# EAGLE schematic Shifter (EAGLE 9.4.2)
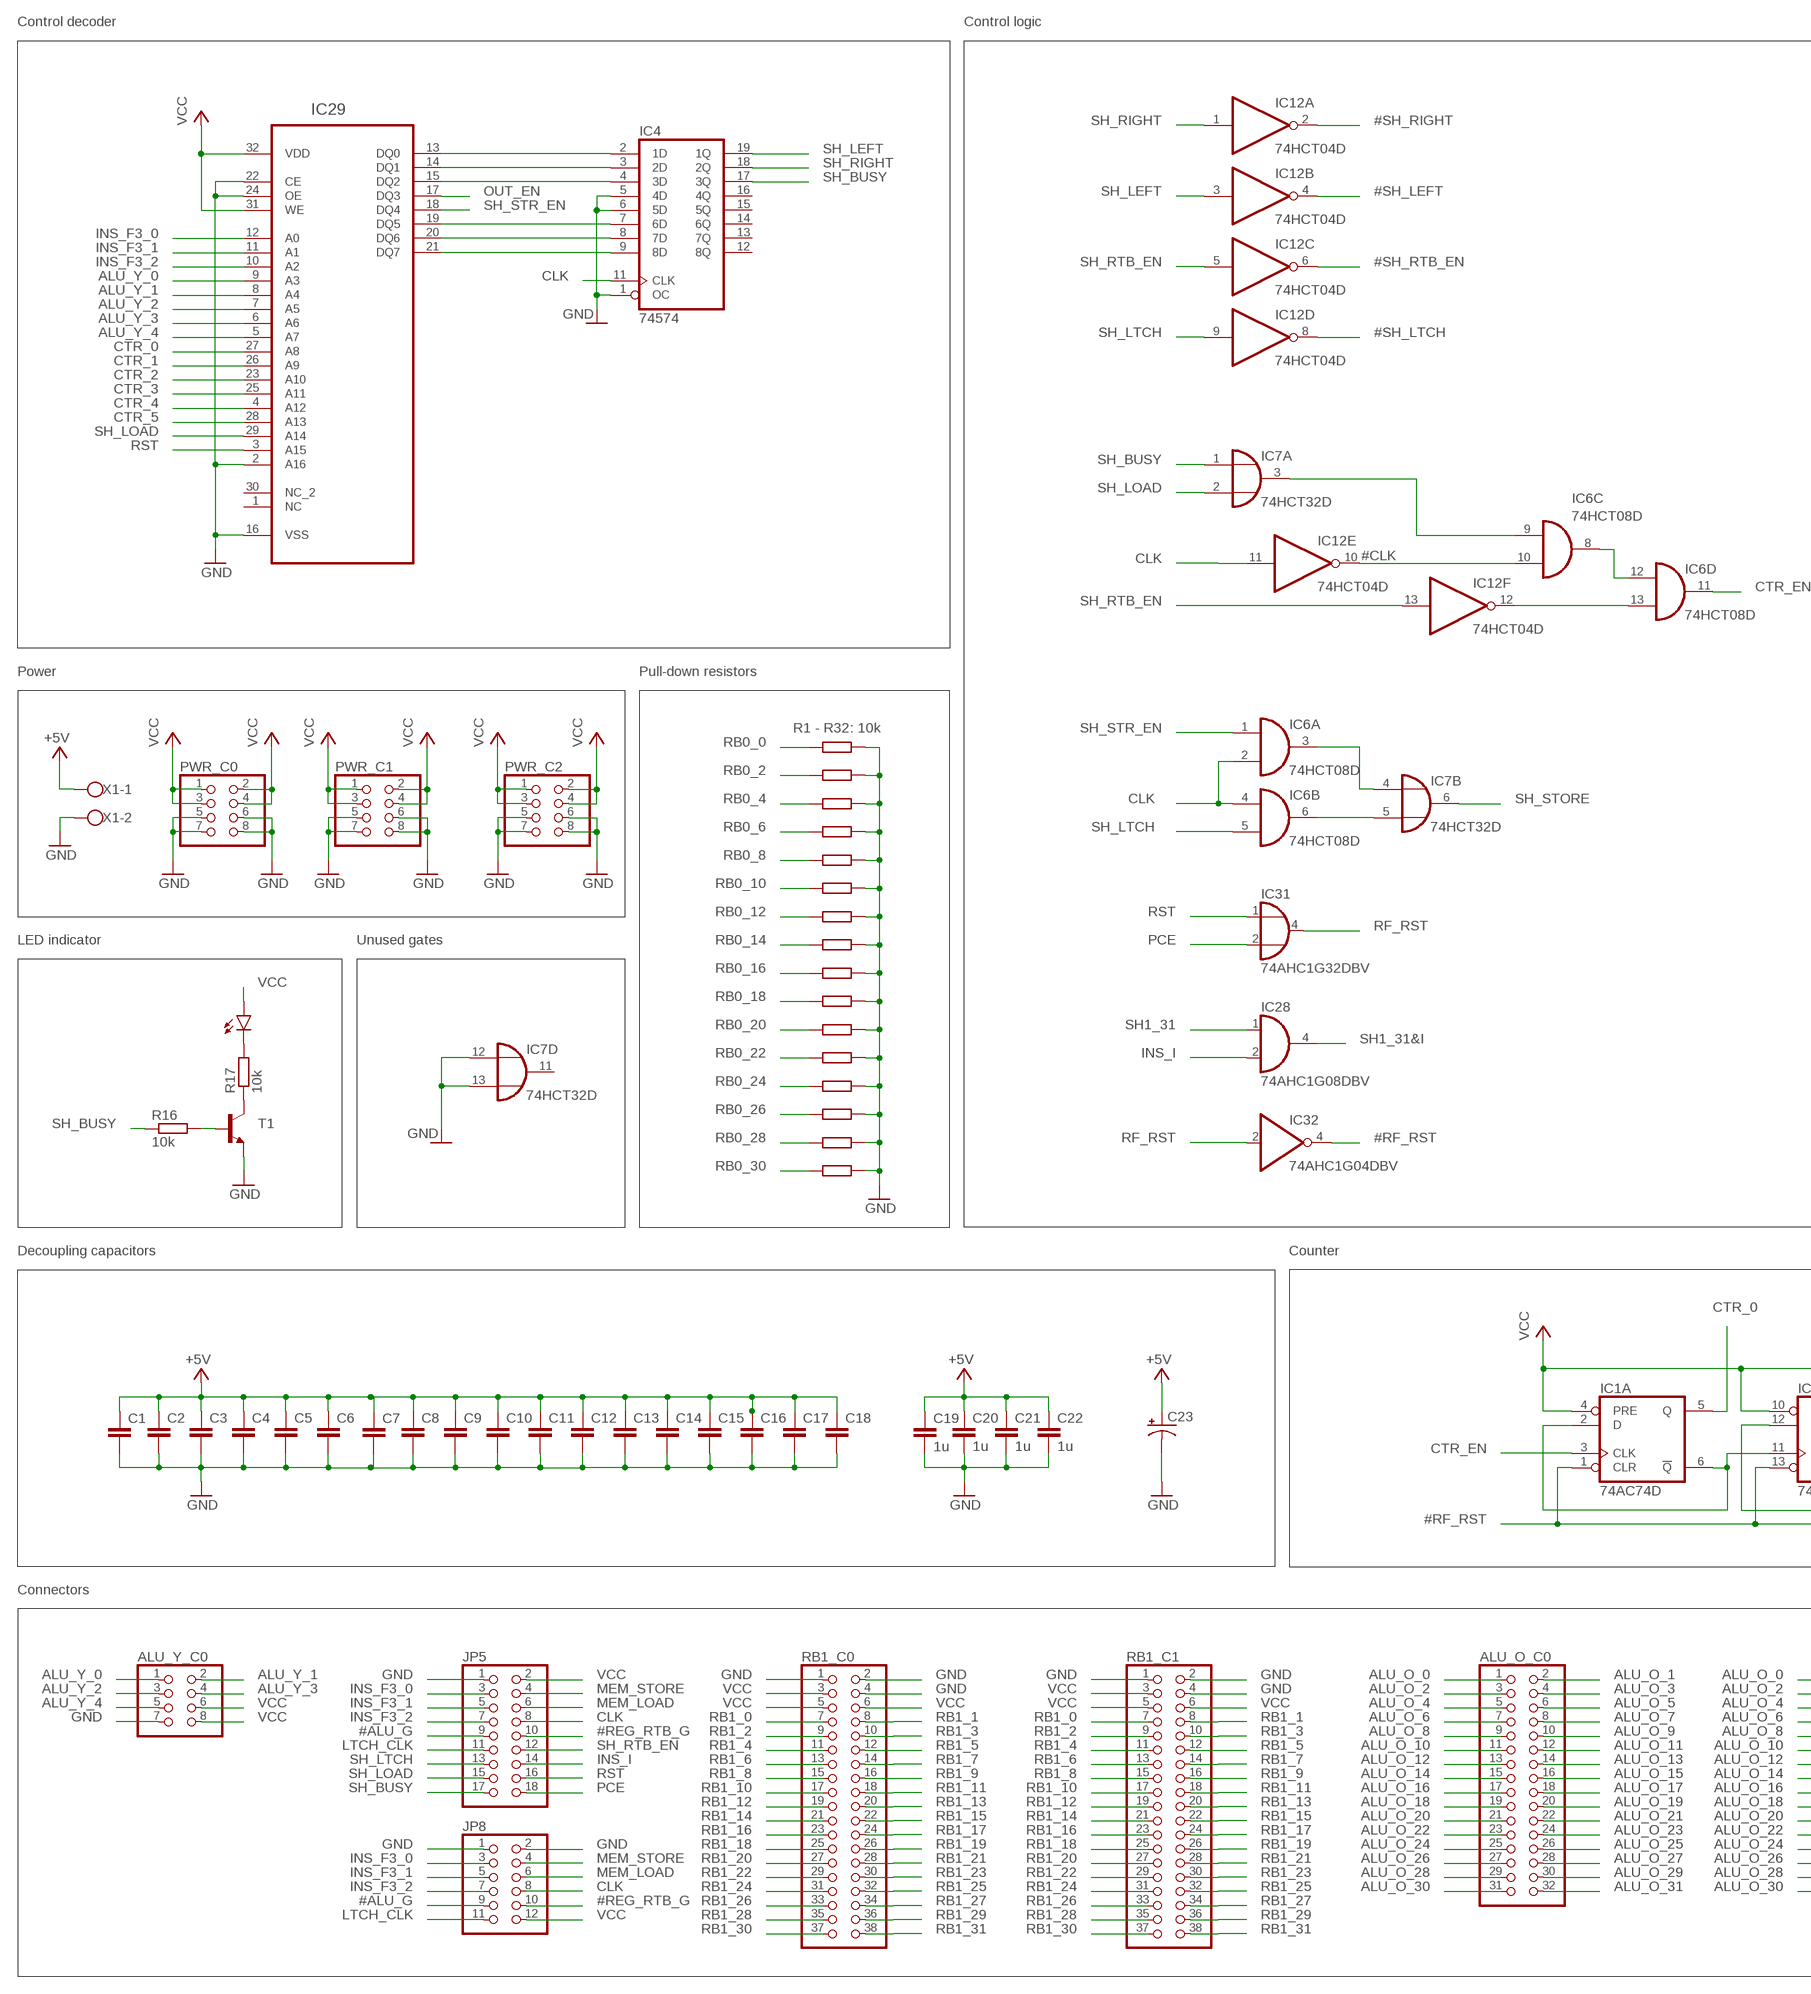
[diagram p0: schematic, sheet 1, part 1 of 2]
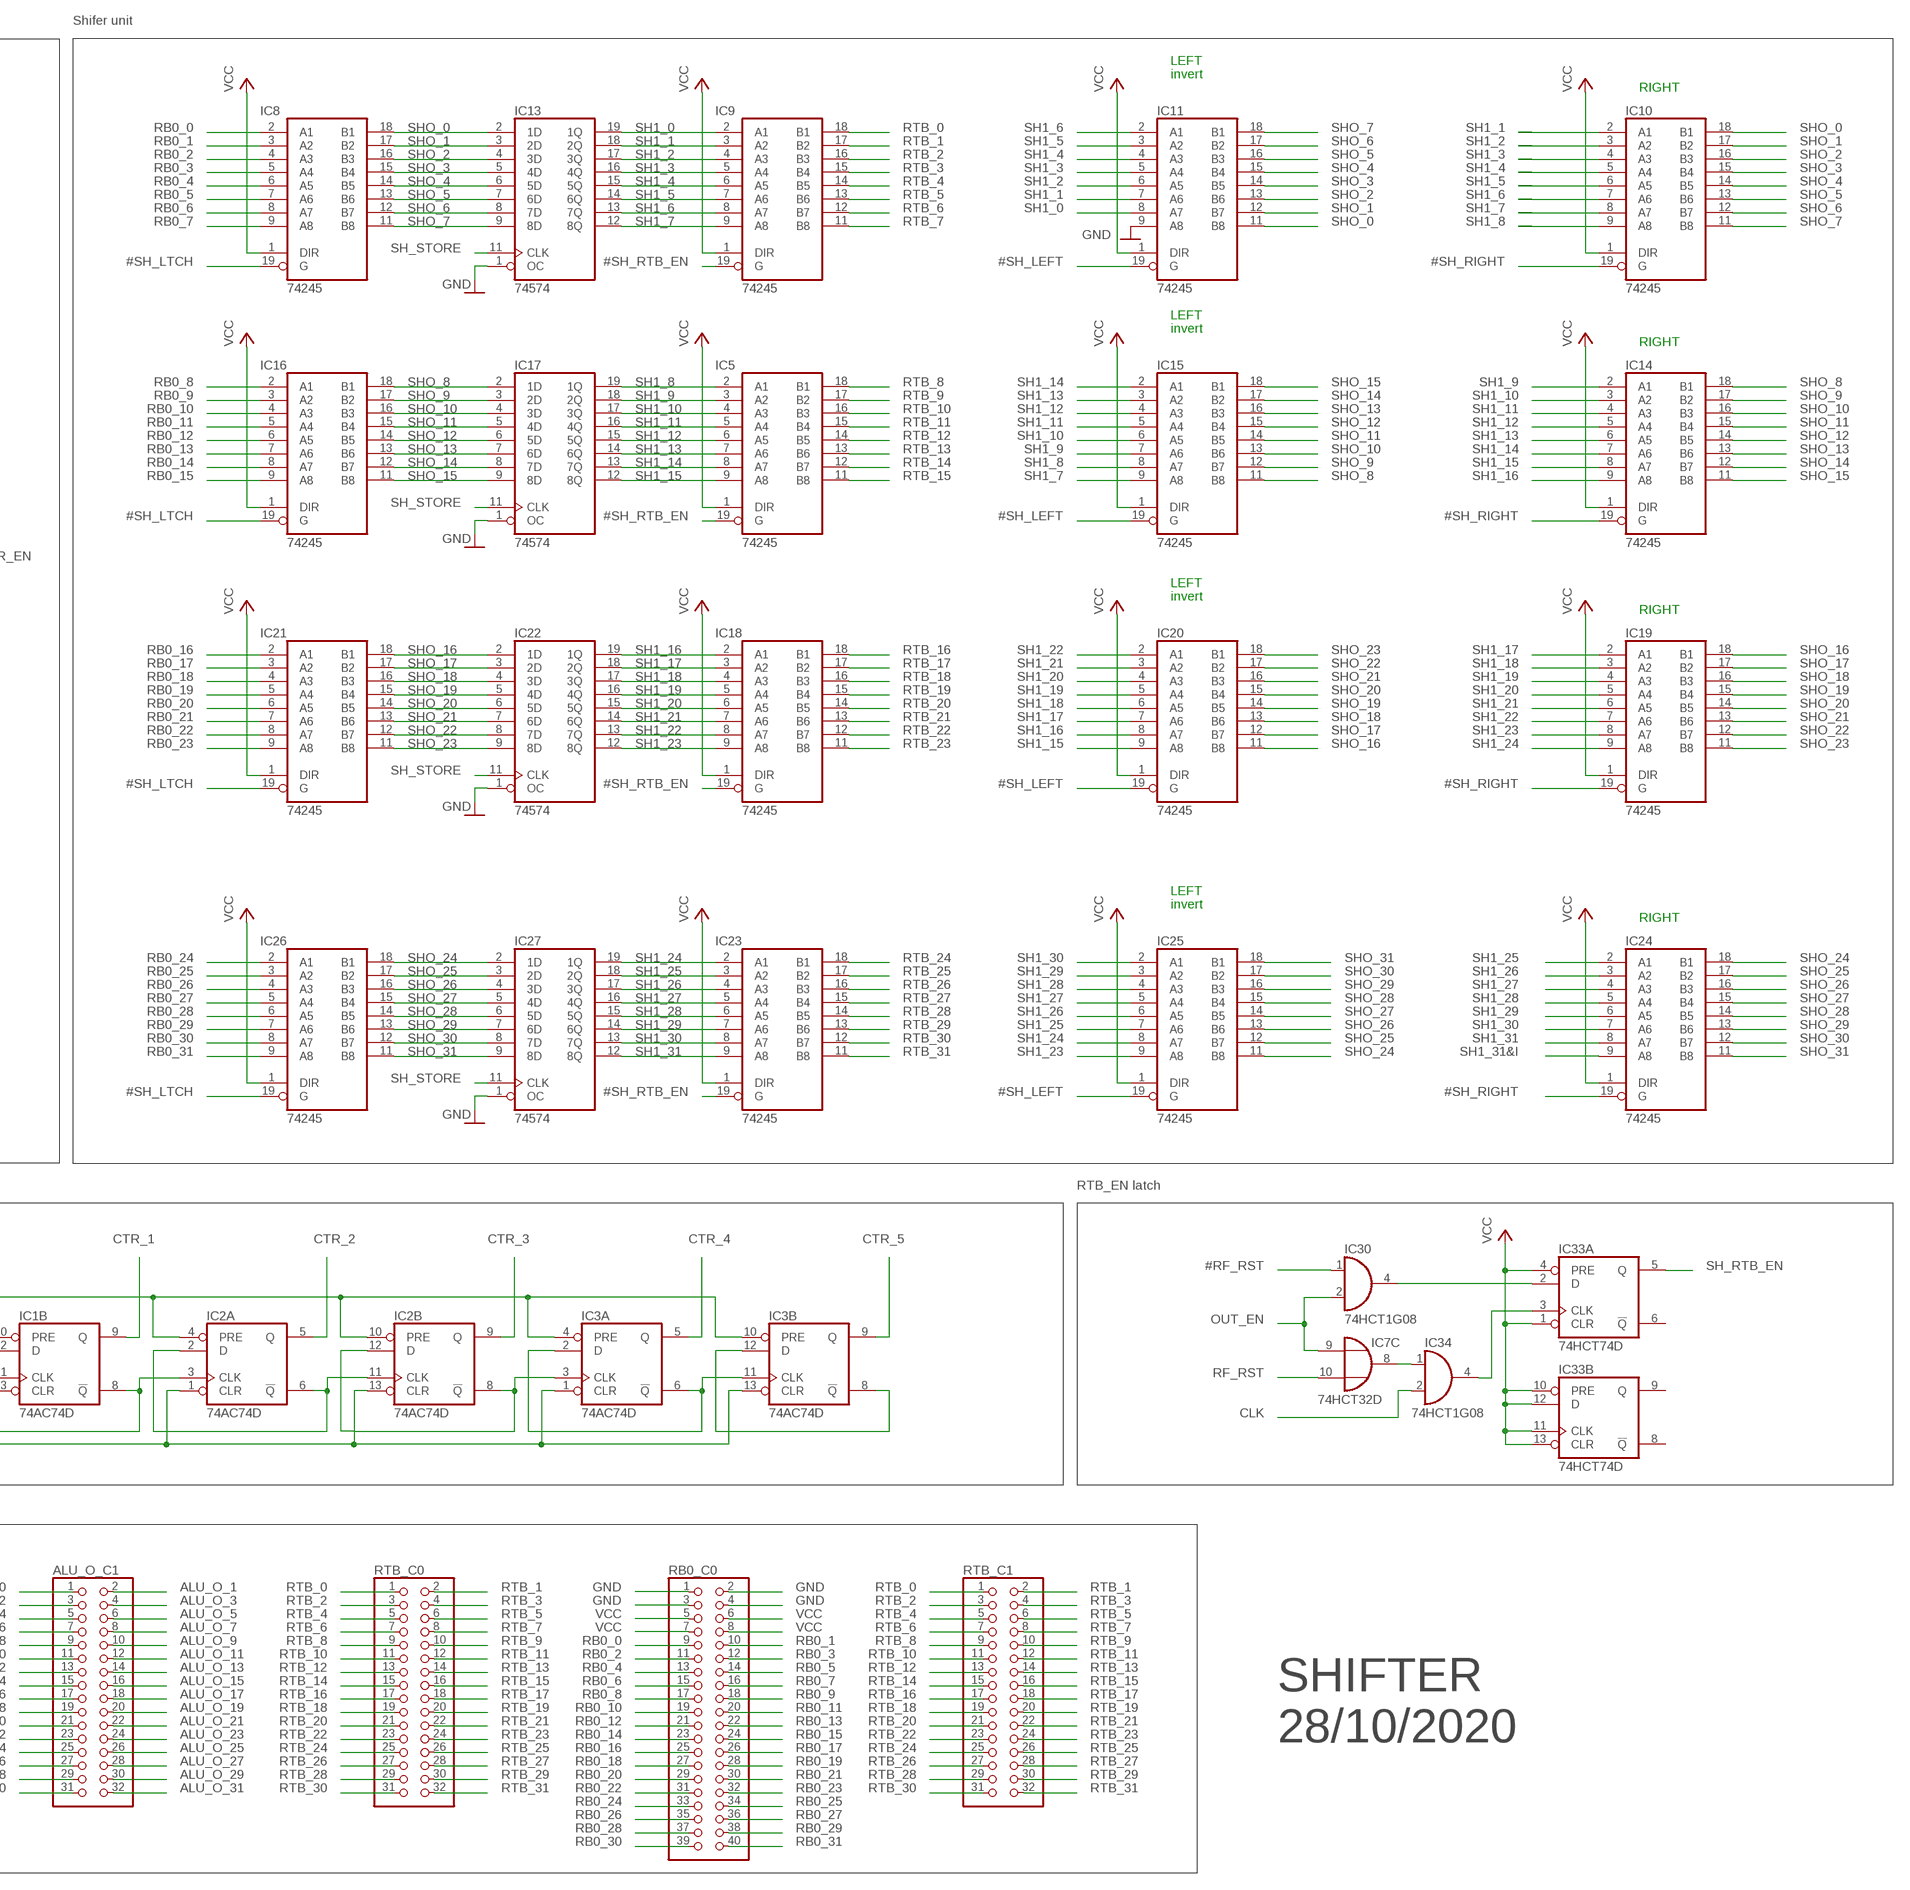
[diagram p1: schematic, sheet 1, part 2 of 2]

## Parts
ALU_O_C0  PINHD-2X16  [2X16]
ALU_O_C1  PINHD-2X16  [2X16]
ALU_Y_C0  PINHD-2X4  [2X04]
C1  C-EUC0805  [C0805]
C2  C-EUC0805  [C0805]
C3  C-EUC0805  [C0805]
C4  C-EUC0805  [C0805]
C5  C-EUC0805  [C0805]
C6  C-EUC0805  [C0805]
C7  C-EUC0805  [C0805]
C8  C-EUC0805  [C0805]
C9  C-EUC0805  [C0805]
C10  C-EUC0805  [C0805]
C11  C-EUC0805  [C0805]
C12  C-EUC0805  [C0805]
C13  C-EUC0805  [C0805]
C14  C-EUC0805  [C0805]
C15  C-EUC0805  [C0805]
C16  C-EUC0805  [C0805]
C17  C-EUC0805  [C0805]
C18  C-EUC0805  [C0805]
C19  1u  C-EUC0805  [C0805]
C20  1u  C-EUC0805  [C0805]
C21  1u  C-EUC0805  [C0805]
C22  1u  C-EUC0805  [C0805]
C23  CAPACITOR-P153CLV-1010  [153CLV-1010]
IC1  74AC74D  [SO14]
IC2  74AC74D  [SO14]
IC3  74AC74D  [SO14]
IC4  74574  [TSSOP20]
IC5  74245  [TSSOP20]
IC6  74HCT08D  [SO14]
IC7  74HCT32D  [SO14]
IC8  74245  [TSSOP20]
IC9  74245  [TSSOP20]
IC10  74245  [TSSOP20]
IC11  74245  [TSSOP20]
IC12  74HCT04D  [SO14]
IC13  74574  [TSSOP20]
IC14  74245  [TSSOP20]
IC15  74245  [TSSOP20]
IC16  74245  [TSSOP20]
IC17  74574  [TSSOP20]
IC18  74245  [TSSOP20]
IC19  74245  [TSSOP20]
IC20  74245  [TSSOP20]
IC21  74245  [TSSOP20]
IC22  74574  [TSSOP20]
IC23  74245  [TSSOP20]
IC24  74245  [TSSOP20]
IC25  74245  [TSSOP20]
IC26  74245  [TSSOP20]
IC27  74574  [TSSOP20]
IC28  74AHC1G08DBV  [SOT23-5]
IC29  SST39SF010A-70-4I-NHEPLCC32  [S32]
IC30  74HCT1G08  74AHC1G08DBV  [SOT23-5]
IC31  74AHC1G32DBV  [SOT23-5]
IC32  74AHC1G04DBV  [SOT23-5]
IC33  74HCT74D  [SO14]
IC34  74HCT1G08  74AHC1G08DBV  [SOT23-5]
JP5  PINHD-2X9  [2X09]
JP8  PINHD-2X6  [2X06]
LED1  LEDSML0805  [SML0805]
PWR_C0  PINHD-2X4  [2X04]
PWR_C1  PINHD-2X4  [2X04]
PWR_C2  PINHD-2X4  [2X04]
R0  R-EU_R0805  [R0805]
R1  R-EU_R0805  [R0805]
R2  R-EU_R0805  [R0805]
R3  R-EU_R0805  [R0805]
R4  R-EU_R0805  [R0805]
R5  R-EU_R0805  [R0805]
R6  R-EU_R0805  [R0805]
R7  R-EU_R0805  [R0805]
R8  R-EU_R0805  [R0805]
R9  R-EU_R0805  [R0805]
R10  R-EU_R0805  [R0805]
R11  R-EU_R0805  [R0805]
R12  R-EU_R0805  [R0805]
R13  R-EU_R0805  [R0805]
R14  R-EU_R0805  [R0805]
R15  R-EU_R0805  [R0805]
R16  10k  R-EU_M0805  [M0805]
R17  10k  R-EU_M0805  [M0805]
RB0_C0  PINHD-2X20  [2X20]
RB1_C0  PINHD-2X19  [2X19]
RB1_C1  PINHD-2X19  [2X19]
RTB_C0  PINHD-2X16  [2X16]
RTB_C1  PINHD-2X16  [2X16]
T1  MMBT4401LT1-NPN-SOT23-BEC  [SOT23-BEC]
X1  W237-102  [W237-102]

## Nets
#ALU_G: JP5.9 JP8.9
#CLK: IC6.10(C:I1) IC12.10(E:O)
#REG_RTB_G: JP5.10 JP8.10
#RF_RST: IC1.1(A:CLR) IC1.13(B:CLR) IC2.1(A:CLR) IC2.13(B:CLR) IC3.1(A:CLR) IC3.13(B:CLR) IC30.1(I0) IC32.4(O)
#SH_LEFT: IC11.19(G) IC12.4(B:O) IC15.19(G) IC20.19(G) IC25.19(G)
#SH_LTCH: IC8.19(G) IC12.8(D:O) IC16.19(G) IC21.19(G) IC26.19(G)
#SH_RIGHT: IC10.19(G) IC12.2(A:O) IC14.19(G) IC19.19(G) IC24.19(G)
#SH_RTB_EN: IC5.19(G) IC9.19(G) IC12.6(C:O) IC18.19(G) IC23.19(G)
ALU_O_0: ALU_O_C0.1 ALU_O_C1.1
ALU_O_1: ALU_O_C0.2 ALU_O_C1.2
ALU_O_2: ALU_O_C0.3 ALU_O_C1.3
ALU_O_3: ALU_O_C0.4 ALU_O_C1.4
ALU_O_4: ALU_O_C0.5 ALU_O_C1.5
ALU_O_5: ALU_O_C0.6 ALU_O_C1.6
ALU_O_6: ALU_O_C0.7 ALU_O_C1.7
ALU_O_7: ALU_O_C0.8 ALU_O_C1.8
ALU_O_8: ALU_O_C0.9 ALU_O_C1.9
ALU_O_9: ALU_O_C0.10 ALU_O_C1.10
ALU_O_10: ALU_O_C0.11 ALU_O_C1.11
ALU_O_11: ALU_O_C0.12 ALU_O_C1.12
ALU_O_12: ALU_O_C0.13 ALU_O_C1.13
ALU_O_13: ALU_O_C0.14 ALU_O_C1.14
ALU_O_14: ALU_O_C0.15 ALU_O_C1.15
ALU_O_15: ALU_O_C0.16 ALU_O_C1.16
ALU_O_16: ALU_O_C0.17 ALU_O_C1.17
ALU_O_17: ALU_O_C0.18 ALU_O_C1.18
ALU_O_18: ALU_O_C0.19 ALU_O_C1.19
ALU_O_19: ALU_O_C0.20 ALU_O_C1.20
ALU_O_20: ALU_O_C0.21 ALU_O_C1.21
ALU_O_21: ALU_O_C0.22 ALU_O_C1.22
ALU_O_22: ALU_O_C0.23 ALU_O_C1.23
ALU_O_23: ALU_O_C0.24 ALU_O_C1.24
ALU_O_24: ALU_O_C0.25 ALU_O_C1.25
ALU_O_25: ALU_O_C0.26 ALU_O_C1.26
ALU_O_26: ALU_O_C0.27 ALU_O_C1.27
ALU_O_27: ALU_O_C0.28 ALU_O_C1.28
ALU_O_28: ALU_O_C0.29 ALU_O_C1.29
ALU_O_29: ALU_O_C0.30 ALU_O_C1.30
ALU_O_30: ALU_O_C0.31 ALU_O_C1.31
ALU_O_31: ALU_O_C0.32 ALU_O_C1.32
ALU_Y_0: ALU_Y_C0.1 IC29.9(A3)
ALU_Y_1: ALU_Y_C0.2 IC29.8(A4)
ALU_Y_2: ALU_Y_C0.3 IC29.7(A5)
ALU_Y_3: ALU_Y_C0.4 IC29.6(A6)
ALU_Y_4: ALU_Y_C0.5 IC29.5(A7)
CLK: IC4.11(CLK) IC6.2(A:I1) IC6.4(B:I0) IC12.11(E:I) IC34.2(I1) JP5.8 JP8.8
CTR_0: IC1.5(A:Q) IC29.27(A8)
CTR_1: IC1.9(B:Q) IC29.26(A9)
CTR_2: IC2.5(A:Q) IC29.23(A10)
CTR_3: IC2.9(B:Q) IC29.25(A11)
CTR_4: IC3.5(A:Q) IC29.4(A12)
CTR_5: IC3.9(B:Q) IC29.28(A13)
CTR_EN: IC1.3(A:CLK) IC6.11(D:O)
GND: ALU_Y_C0.7 C1.2 C2.2 C3.2 C4.2 C5.2 C6.2 C7.2 C8.2 C9.2 C10.2 C11.2 C12.2 C13.2 C14.2 C15.2 C16.2 C17.2 C18.2 C19.2 C20.2 C21.2 C22.2 C23.- IC4.1(OC) IC4.5(4D) IC4.6(5D) IC7.12(D:I0) IC7.13(D:I1) IC11.9(A8) IC13.1(OC) IC17.1(OC) IC22.1(OC) IC27.1(OC) IC29.2(A16) IC29.16(VSS) IC29.22(CE) IC29.24(OE) JP5.1 JP8.1 JP8.2 PWR_C0.5 PWR_C0.6 PWR_C0.7 PWR_C0.8 PWR_C1.5 PWR_C1.6 PWR_C1.7 PWR_C1.8 PWR_C2.5 PWR_C2.6 PWR_C2.7 PWR_C2.8 R0.2 R1.2 R2.2 R3.2 R4.2 R5.2 R6.2 R7.2 R8.2 R9.2 R10.2 R11.2 R12.2 R13.2 R14.2 R15.2 RB0_C0.1 RB0_C0.2 RB0_C0.3 RB0_C0.4 RB1_C0.1 RB1_C0.2 RB1_C0.4 RB1_C1.1 RB1_C1.2 RB1_C1.4 T1.E X1.2
INS_F3_0: IC29.12(A0) JP5.3 JP8.3
INS_F3_1: IC29.11(A1) JP5.5 JP8.5
INS_F3_2: IC29.10(A2) JP5.7 JP8.7
INS_I: IC28.2(I1) JP5.14
LTCH_CLK: JP5.11 JP8.11
MEM_LOAD: JP5.6 JP8.6
MEM_STORE: JP5.4 JP8.4
N$1: IC1.2(A:D) IC1.6(A:!Q) IC1.11(B:CLK)
N$2: IC4.2(1D) IC29.13(DQ0)
N$3: IC4.3(2D) IC29.14(DQ1)
N$4: IC4.4(3D) IC29.15(DQ2)
N$5: IC3.2(A:D) IC3.6(A:!Q) IC3.11(B:CLK)
N$6: IC3.8(B:!Q) IC3.12(B:D)
N$7: IC1.8(B:!Q) IC1.12(B:D) IC2.3(A:CLK)
N$8: IC7.8(C:O) IC34.1(I0)
N$9: IC2.2(A:D) IC2.6(A:!Q) IC2.11(B:CLK)
N$10: IC30.4(O) IC33.2(A:D)
N$11: IC4.7(6D) IC29.19(DQ5)
N$12: IC4.8(7D) IC29.20(DQ6)
N$13: IC2.8(B:!Q) IC2.12(B:D) IC3.3(A:CLK)
N$14: IC4.9(8D) IC29.21(DQ7)
N$15: IC6.9(C:I0) IC7.3(A:O)
N$16: IC6.8(C:O) IC6.12(D:I0)
N$17: IC6.13(D:I1) IC12.12(F:O)
N$18: IC33.3(A:CLK) IC34.4(O)
N$19: IC6.6(B:O) IC7.5(B:I1)
N$22: R16.2 T1.B
N$23: LED1.C R17.2
N$24: R17.1 T1.C
OUT_EN: IC7.9(C:I0) IC29.17(DQ3) IC30.2(I1)
PCE: IC31.2(I1) JP5.18
RB0_0: IC8.2(A1) R0.1 RB0_C0.9
RB0_1: IC8.3(A2) RB0_C0.10
RB0_2: IC8.4(A3) R1.1 RB0_C0.11
RB0_3: IC8.5(A4) RB0_C0.12
RB0_4: IC8.6(A5) R2.1 RB0_C0.13
RB0_5: IC8.7(A6) RB0_C0.14
RB0_6: IC8.8(A7) R3.1 RB0_C0.15
RB0_7: IC8.9(A8) RB0_C0.16
RB0_8: IC16.2(A1) R4.1 RB0_C0.17
RB0_9: IC16.3(A2) RB0_C0.18
RB0_10: IC16.4(A3) R5.1 RB0_C0.19
RB0_11: IC16.5(A4) RB0_C0.20
RB0_12: IC16.6(A5) R6.1 RB0_C0.21
RB0_13: IC16.7(A6) RB0_C0.22
RB0_14: IC16.8(A7) R7.1 RB0_C0.23
RB0_15: IC16.9(A8) RB0_C0.24
RB0_16: IC21.2(A1) R8.1 RB0_C0.25
RB0_17: IC21.3(A2) RB0_C0.26
RB0_18: IC21.4(A3) R9.1 RB0_C0.27
RB0_19: IC21.5(A4) RB0_C0.28
RB0_20: IC21.6(A5) R10.1 RB0_C0.29
RB0_21: IC21.7(A6) RB0_C0.30
RB0_22: IC21.8(A7) R11.1 RB0_C0.31
RB0_23: IC21.9(A8) RB0_C0.32
RB0_24: IC26.2(A1) R12.1 RB0_C0.33
RB0_25: IC26.3(A2) RB0_C0.34
RB0_26: IC26.4(A3) R13.1 RB0_C0.35
RB0_27: IC26.5(A4) RB0_C0.36
RB0_28: IC26.6(A5) R14.1 RB0_C0.37
RB0_29: IC26.7(A6) RB0_C0.38
RB0_30: IC26.8(A7) R15.1 RB0_C0.39
RB0_31: IC26.9(A8) RB0_C0.40
RB1_0: RB1_C0.7 RB1_C1.7
RB1_1: RB1_C0.8 RB1_C1.8
RB1_2: RB1_C0.9 RB1_C1.9
RB1_3: RB1_C0.10 RB1_C1.10
RB1_4: RB1_C0.11 RB1_C1.11
RB1_5: RB1_C0.12 RB1_C1.12
RB1_6: RB1_C0.13 RB1_C1.13
RB1_7: RB1_C0.14 RB1_C1.14
RB1_8: RB1_C0.15 RB1_C1.15
RB1_9: RB1_C0.16 RB1_C1.16
RB1_10: RB1_C0.17 RB1_C1.17
RB1_11: RB1_C0.18 RB1_C1.18
RB1_12: RB1_C0.19 RB1_C1.19
RB1_13: RB1_C0.20 RB1_C1.20
RB1_14: RB1_C0.21 RB1_C1.21
RB1_15: RB1_C0.22 RB1_C1.22
RB1_16: RB1_C0.23 RB1_C1.23
RB1_17: RB1_C0.24 RB1_C1.24
RB1_18: RB1_C0.25 RB1_C1.25
RB1_19: RB1_C0.26 RB1_C1.26
RB1_20: RB1_C0.27 RB1_C1.27
RB1_21: RB1_C0.28 RB1_C1.28
RB1_22: RB1_C0.29 RB1_C1.29
RB1_23: RB1_C0.30 RB1_C1.30
RB1_24: RB1_C0.31 RB1_C1.31
RB1_25: RB1_C0.32 RB1_C1.32
RB1_26: RB1_C0.33 RB1_C1.33
RB1_27: RB1_C0.34 RB1_C1.34
RB1_28: RB1_C0.35 RB1_C1.35
RB1_29: RB1_C0.36 RB1_C1.36
RB1_30: RB1_C0.37 RB1_C1.37
RB1_31: RB1_C0.38 RB1_C1.38
RF_RST: IC7.10(C:I1) IC31.4(O) IC32.2(I)
RST: IC29.3(A15) IC31.1(I0) JP5.16
RTB_0: IC9.18(B1) RTB_C0.1 RTB_C1.1
RTB_1: IC9.17(B2) RTB_C0.2 RTB_C1.2
RTB_2: IC9.16(B3) RTB_C0.3 RTB_C1.3
RTB_3: IC9.15(B4) RTB_C0.4 RTB_C1.4
RTB_4: IC9.14(B5) RTB_C0.5 RTB_C1.5
RTB_5: IC9.13(B6) RTB_C0.6 RTB_C1.6
RTB_6: IC9.12(B7) RTB_C0.7 RTB_C1.7
RTB_7: IC9.11(B8) RTB_C0.8 RTB_C1.8
RTB_8: IC5.18(B1) RTB_C0.9 RTB_C1.9
RTB_9: IC5.17(B2) RTB_C0.10 RTB_C1.10
RTB_10: IC5.16(B3) RTB_C0.11 RTB_C1.11
RTB_11: IC5.15(B4) RTB_C0.12 RTB_C1.12
RTB_12: IC5.14(B5) RTB_C0.13 RTB_C1.13
RTB_13: IC5.13(B6) RTB_C0.14 RTB_C1.14
RTB_14: IC5.12(B7) RTB_C0.15 RTB_C1.15
RTB_15: IC5.11(B8) RTB_C0.16 RTB_C1.16
RTB_16: IC18.18(B1) RTB_C0.17 RTB_C1.17
RTB_17: IC18.17(B2) RTB_C0.18 RTB_C1.18
RTB_18: IC18.16(B3) RTB_C0.19 RTB_C1.19
RTB_19: IC18.15(B4) RTB_C0.20 RTB_C1.20
RTB_20: IC18.14(B5) RTB_C0.21 RTB_C1.21
RTB_21: IC18.13(B6) RTB_C0.22 RTB_C1.22
RTB_22: IC18.12(B7) RTB_C0.23 RTB_C1.23
RTB_23: IC18.11(B8) RTB_C0.24 RTB_C1.24
RTB_24: IC23.18(B1) RTB_C0.25 RTB_C1.25
RTB_25: IC23.17(B2) RTB_C0.26 RTB_C1.26
RTB_26: IC23.16(B3) RTB_C0.27 RTB_C1.27
RTB_27: IC23.15(B4) RTB_C0.28 RTB_C1.28
RTB_28: IC23.14(B5) RTB_C0.29 RTB_C1.29
RTB_29: IC23.13(B6) RTB_C0.30 RTB_C1.30
RTB_30: IC23.12(B7) RTB_C0.31 RTB_C1.31
RTB_31: IC23.11(B8) RTB_C0.32 RTB_C1.32
SH1_0: IC9.2(A1) IC11.8(A7) IC13.19(1Q)
SH1_1: IC9.3(A2) IC10.2(A1) IC11.7(A6) IC13.18(2Q)
SH1_2: IC9.4(A3) IC10.3(A2) IC11.6(A5) IC13.17(3Q)
SH1_3: IC9.5(A4) IC10.4(A3) IC11.5(A4) IC13.16(4Q)
SH1_4: IC9.6(A5) IC10.5(A4) IC11.4(A3) IC13.15(5Q)
SH1_5: IC9.7(A6) IC10.6(A5) IC11.3(A2) IC13.14(6Q)
SH1_6: IC9.8(A7) IC10.7(A6) IC11.2(A1) IC13.13(7Q)
SH1_7: IC9.9(A8) IC10.8(A7) IC13.12(8Q) IC15.9(A8)
SH1_8: IC5.2(A1) IC10.9(A8) IC15.8(A7) IC17.19(1Q)
SH1_9: IC5.3(A2) IC14.2(A1) IC15.7(A6) IC17.18(2Q)
SH1_10: IC5.4(A3) IC14.3(A2) IC15.6(A5) IC17.17(3Q)
SH1_11: IC5.5(A4) IC14.4(A3) IC15.5(A4) IC17.16(4Q)
SH1_12: IC5.6(A5) IC14.5(A4) IC15.4(A3) IC17.15(5Q)
SH1_13: IC5.7(A6) IC14.6(A5) IC15.3(A2) IC17.14(6Q)
SH1_14: IC5.8(A7) IC14.7(A6) IC15.2(A1) IC17.13(7Q)
SH1_15: IC5.9(A8) IC14.8(A7) IC17.12(8Q) IC20.9(A8)
SH1_16: IC14.9(A8) IC18.2(A1) IC20.8(A7) IC22.19(1Q)
SH1_17: IC18.3(A2) IC19.2(A1) IC20.7(A6) IC22.18(2Q)
SH1_18: IC18.4(A3) IC19.3(A2) IC20.6(A5) IC22.17(3Q)
SH1_19: IC18.5(A4) IC19.4(A3) IC20.5(A4) IC22.16(4Q)
SH1_20: IC18.6(A5) IC19.5(A4) IC20.4(A3) IC22.15(5Q)
SH1_21: IC18.7(A6) IC19.6(A5) IC20.3(A2) IC22.14(6Q)
SH1_22: IC18.8(A7) IC19.7(A6) IC20.2(A1) IC22.13(7Q)
SH1_23: IC18.9(A8) IC19.8(A7) IC22.12(8Q) IC25.9(A8)
SH1_24: IC19.9(A8) IC23.2(A1) IC25.8(A7) IC27.19(1Q)
SH1_25: IC23.3(A2) IC24.2(A1) IC25.7(A6) IC27.18(2Q)
SH1_26: IC23.4(A3) IC24.3(A2) IC25.6(A5) IC27.17(3Q)
SH1_27: IC23.5(A4) IC24.4(A3) IC25.5(A4) IC27.16(4Q)
SH1_28: IC23.6(A5) IC24.5(A4) IC25.4(A3) IC27.15(5Q)
SH1_29: IC23.7(A6) IC24.6(A5) IC25.3(A2) IC27.14(6Q)
SH1_30: IC23.8(A7) IC24.7(A6) IC25.2(A1) IC27.13(7Q)
SH1_31: IC23.9(A8) IC24.8(A7) IC27.12(8Q) IC28.1(I0)
SH1_31&I: IC24.9(A8) IC28.4(O)
SH_BUSY: IC4.17(3Q) IC7.1(A:I0) JP5.17 R16.1
SH_EN: IC6.3(A:O) IC7.4(B:I0)
SH_LEFT: IC4.19(1Q) IC12.3(B:I)
SH_LOAD: IC7.2(A:I1) IC29.29(A14) JP5.15
SH_LTCH: IC6.5(B:I1) IC12.9(D:I) JP5.13
SH_RIGHT: IC4.18(2Q) IC12.1(A:I)
SH_RTB_EN: IC12.5(C:I) IC12.13(F:I) IC33.5(A:Q) JP5.12
SH_STORE: IC7.6(B:O) IC13.11(CLK) IC17.11(CLK) IC22.11(CLK) IC27.11(CLK)
SH_STR_EN: IC6.1(A:I0) IC29.18(DQ4)
SHO_0: IC8.18(B1) IC10.18(B1) IC11.11(B8) IC13.2(1D)
SHO_1: IC8.17(B2) IC10.17(B2) IC11.12(B7) IC13.3(2D)
SHO_2: IC8.16(B3) IC10.16(B3) IC11.13(B6) IC13.4(3D)
SHO_3: IC8.15(B4) IC10.15(B4) IC11.14(B5) IC13.5(4D)
SHO_4: IC8.14(B5) IC10.14(B5) IC11.15(B4) IC13.6(5D)
SHO_5: IC8.13(B6) IC10.13(B6) IC11.16(B3) IC13.7(6D)
SHO_6: IC8.12(B7) IC10.12(B7) IC11.17(B2) IC13.8(7D)
SHO_7: IC8.11(B8) IC10.11(B8) IC11.18(B1) IC13.9(8D)
SHO_8: IC14.18(B1) IC15.11(B8) IC16.18(B1) IC17.2(1D)
SHO_9: IC14.17(B2) IC15.12(B7) IC16.17(B2) IC17.3(2D)
SHO_10: IC14.16(B3) IC15.13(B6) IC16.16(B3) IC17.4(3D)
SHO_11: IC14.15(B4) IC15.14(B5) IC16.15(B4) IC17.5(4D)
SHO_12: IC14.14(B5) IC15.15(B4) IC16.14(B5) IC17.6(5D)
SHO_13: IC14.13(B6) IC15.16(B3) IC16.13(B6) IC17.7(6D)
SHO_14: IC14.12(B7) IC15.17(B2) IC16.12(B7) IC17.8(7D)
SHO_15: IC14.11(B8) IC15.18(B1) IC16.11(B8) IC17.9(8D)
SHO_16: IC19.18(B1) IC20.11(B8) IC21.18(B1) IC22.2(1D)
SHO_17: IC19.17(B2) IC20.12(B7) IC21.17(B2) IC22.3(2D)
SHO_18: IC19.16(B3) IC20.13(B6) IC21.16(B3) IC22.4(3D)
SHO_19: IC19.15(B4) IC20.14(B5) IC21.15(B4) IC22.5(4D)
SHO_20: IC19.14(B5) IC20.15(B4) IC21.14(B5) IC22.6(5D)
SHO_21: IC19.13(B6) IC20.16(B3) IC21.13(B6) IC22.7(6D)
SHO_22: IC19.12(B7) IC20.17(B2) IC21.12(B7) IC22.8(7D)
SHO_23: IC19.11(B8) IC20.18(B1) IC21.11(B8) IC22.9(8D)
SHO_24: IC24.18(B1) IC25.11(B8) IC26.18(B1) IC27.2(1D)
SHO_25: IC24.17(B2) IC25.12(B7) IC26.17(B2) IC27.3(2D)
SHO_26: IC24.16(B3) IC25.13(B6) IC26.16(B3) IC27.4(3D)
SHO_27: IC24.15(B4) IC25.14(B5) IC26.15(B4) IC27.5(4D)
SHO_28: IC24.14(B5) IC25.15(B4) IC26.14(B5) IC27.6(5D)
SHO_29: IC24.13(B6) IC25.16(B3) IC26.13(B6) IC27.7(6D)
SHO_30: IC24.12(B7) IC25.17(B2) IC26.12(B7) IC27.8(7D)
SHO_31: IC24.11(B8) IC25.18(B1) IC26.11(B8) IC27.9(8D)
VCC: ALU_Y_C0.6 ALU_Y_C0.8 C1.1 C2.1 C3.1 C4.1 C5.1 C6.1 C7.1 C8.1 C9.1 C10.1 C11.1 C12.1 C13.1 C14.1 C15.1 C16.1 C17.1 C18.1 C19.1 C20.1 C21.1 C22.1 C23.+ IC1.4(A:PRE) IC1.10(B:PRE) IC2.4(A:PRE) IC2.10(B:PRE) IC3.4(A:PRE) IC3.10(B:PRE) IC5.1(DIR) IC8.1(DIR) IC9.1(DIR) IC10.1(DIR) IC11.1(DIR) IC14.1(DIR) IC15.1(DIR) IC16.1(DIR) IC18.1(DIR) IC19.1(DIR) IC20.1(DIR) IC21.1(DIR) IC23.1(DIR) IC24.1(DIR) IC25.1(DIR) IC26.1(DIR) IC29.31(WE) IC29.32(VDD) IC33.1(A:CLR) IC33.4(A:PRE) IC33.10(B:PRE) IC33.11(B:CLK) IC33.12(B:D) IC33.13(B:CLR) JP5.2 JP8.12 LED1.A PWR_C0.1 PWR_C0.2 PWR_C0.3 PWR_C0.4 PWR_C1.1 PWR_C1.2 PWR_C1.3 PWR_C1.4 PWR_C2.1 PWR_C2.2 PWR_C2.3 PWR_C2.4 RB0_C0.5 RB0_C0.6 RB0_C0.7 RB0_C0.8 RB1_C0.3 RB1_C0.5 RB1_C0.6 RB1_C1.3 RB1_C1.5 RB1_C1.6 X1.1 ; supply symbol labelled +5V
Unconnected: IC4.12(8Q) IC4.13(7Q) IC4.14(6Q) IC4.15(5Q) IC4.16(4Q) IC7.11(D:O) IC29.1(NC) IC29.30(NC_2) IC33.6(A:!Q) IC33.8(B:!Q) IC33.9(B:Q)

## Notes on the sheet
- Control decoder | Control logic | Shifer unit
- LEFT
- invert
- RIGHT
- LEFT
- invert
- RIGHT
- LEFT
- invert
- RIGHT
- Power | Pull-down resistors
- R1 - R32: 10k
- LED indicator | Unused gates | LEFT
- invert
- RIGHT
- Decoupling capacitors | Counter | RTB_EN latch
- Connectors
- SHIFTER
  28/10/2020

## Power pins joined to a net without a drawn wire
GND: IC1.7(P:GND) IC2.7(P:GND) IC3.7(P:GND) IC4.10(GND) IC5.10(GND) IC6.7(P:GND) IC7.7(P:GND) IC8.10(GND) IC9.10(GND) IC10.10(GND) IC11.10(GND) IC12.7(P:GND) IC13.10(GND) IC14.10(GND) IC15.10(GND) IC16.10(GND) IC17.10(GND) IC18.10(GND) IC19.10(GND) IC20.10(GND) IC21.10(GND) IC22.10(GND) IC23.10(GND) IC24.10(GND) IC25.10(GND) IC26.10(GND) IC27.10(GND) IC28.3(GND) IC30.3(GND) IC31.3(GND) IC32.3(GND) IC33.7(P:GND) IC34.3(GND)
VCC: IC1.14(P:VCC) IC2.14(P:VCC) IC3.14(P:VCC) IC4.20(VCC) IC5.20(VCC) IC6.14(P:VCC) IC7.14(P:VCC) IC8.20(VCC) IC9.20(VCC) IC10.20(VCC) IC11.20(VCC) IC12.14(P:VCC) IC13.20(VCC) IC14.20(VCC) IC15.20(VCC) IC16.20(VCC) IC17.20(VCC) IC18.20(VCC) IC19.20(VCC) IC20.20(VCC) IC21.20(VCC) IC22.20(VCC) IC23.20(VCC) IC24.20(VCC) IC25.20(VCC) IC26.20(VCC) IC27.20(VCC) IC28.5(VCC) IC30.5(VCC) IC31.5(VCC) IC32.5(VCC) IC33.14(P:VCC) IC34.5(VCC)

## Library data of the parts
ALU_O_C0 RTB_C1 = pinhead:PINHD-2X16: PIN HEADER
ALU_O_C1 RTB_C0 = pinhead_bottom:PINHD-2X16: PIN HEADER
ALU_Y_C0 PWR_C2 = pinhead_bottom:PINHD-2X4: PIN HEADER
C1-C22 = rcl:C-EU: CAPACITOR, European symbol; SPICEPREFIX: C
C23 = BeagleBone_Blue_R3:CAPACITOR-P: POLARIZED CAPACITOR, American symbol
IC1-IC3 = AAA__74xx-eu:74*74: Dual D type positive edge triggered FLIP FLOP, preset and clear
IC4 IC13 IC17 IC22 IC27 = AAA__74xx-eu:74*574: 8-bit D type FLIP FLOP bus driver
IC5 IC8-IC11 IC14-IC16 IC18-IC21 IC23-IC26 = AAA__74xx-eu:74*245: Octal BUS TRANSCEIVER, 3-state
IC6 = 74xx-eu:74*08: Quad 2-input AND gate
IC7 = 74xx-eu:74*32: Quad 2-input OR gate
IC12 = 74xx-eu:74*04: Hex INVERTER
IC28 IC30 IC34 = 74xx-little-de:74*1G08: 2-input AND gate
IC29 = SST39SF010A-70-4I-NHE:SST39SF010A-70-4I-NHE: 1MB Flash
IC31 = 74xx-little-de:74*1G32: 2-input OR gate
IC32 = 74xx-little-de:74*1G04: INVERTER Gate
IC33 = 74xx-eu:74*74: Dual D type positive edge triggered FLIP FLOP, preset and clear
JP5 = pinhead_bottom:PINHD-2X9: PIN HEADER
JP8 = Connector:PINHD-2X6: PIN HEADER; CATEGORY: CONNECTOR; SUB-CATEGORY: PIN-HEADER
LED1 = led:LED: LED OSRAM: - CHIPLED LG R971, LG N971, LY N971, LG Q971, LY Q971, LO R971, LY R971 LH N974, LH R974 LS Q976, LO Q976, LY Q976 LO Q996 - Hyper CHIPLED LW Q18S LB Q993, LB Q99A, LB R99A - SideLED LS A670, LO A670, LY A670, LG A670, LP A670 LB A673, LV A673, LT A673, LW A673 LH A674 LY A675 LS A676, LA A676, LO A676, LY A676, LW A676 LS A679, LY A679, LG A679 - Hyper Micro SIDELED® LS Y876, LA Y876, LO Y876, LY Y876 LT Y87S - SmartLED LW L88C, LW L88S LB L89C, LB L89S, LG L890 LS L89K, LO L89K, LY L89K LS L896, LA L896, LO L896, LY L896 - TOPLED LS T670, LO T670, LY T670, LG T670, LP T670 LSG T670, LSP T670, LSY T670, LOP T670, LYG T670 LG T671, LOG T671, LSG T671 LB T673, LV T673, LT T673, LW T673 LH T674 LS T676, LA T676, LO T676, LY T676, LB T676, LH T676, LSB T676, LW T676 LB T67C, LV T67C, LT T67C, LS T67K, LO T67K, LY T67K, LW E67C LS E67B, LA E67B, LO E67B, LY E67B, LB E67C, LV E67C, LT E67C LW T67C LS T679, LY T679, LG T679 LS T770, LO T770, LY T770, LG T770, LP T770 LB T773, LV T773, LT T773, LW T773 LH T774 LS E675, LA E675, LY E675, LS T675 LS T776, LA T776, LO T776, LY T776, LB T776 LHGB T686 LT T68C, LB T68C - Hyper Mini TOPLED® LB M676 - Mini TOPLED Santana® LG M470 LS M47K, LO M47K, LY M47K Source: http://www.osram.convergy.de LUXEON: - LUMILED® LXK2-PW12-R00, LXK2-PW12-S00, LXK2-PW14-U00, LXK2-PW14-V00 LXK2-PM12-R00, LXK2-PM12-S00, LXK2-PM14-U00 LXK2-PE12-Q00, LXK2-PE12-R00, LXK2-PE12-S00, LXK2-PE14-T00, LXK2-PE14-U00 LXK2-PB12-K00, LXK2-PB12-L00, LXK2-PB12-M00, LXK2-PB14-N00, LXK2-PB14-P00, LXK2-PB14-Q00 LXK2-PR12-L00, LXK2-PR12-M00, LXK2-PR14-Q00, LXK2-PR14-R00 LXK2-PD12-Q00, LXK2-PD12-R00, LXK2-PD12-S00 LXK2-PH12-R00, LXK2-PH12-S00 LXK2-PL12-P00, LXK2-PL12-Q00, LXK2-PL12-R00 Source: www.luxeon.com KINGBRIGHT: KA-3528ASYC Source: www.kingbright.com
PWR_C0 PWR_C1 = pinhead:PINHD-2X4: PIN HEADER
R0 R1-R17 = rcl:R-EU_: RESISTOR, European symbol; SPICEPREFIX: R
RB0_C0 = pinhead_bottom:PINHD-2X20: PIN HEADER
RB1_C0 = pinhead_bottom:PINHD-2X19: PIN HEADER
RB1_C1 = pinhead:PINHD-2X19: PIN HEADER
T1 = transistor:*-NPN-: NPN Transistror BF959 corrected 2008.03.06
X1 = con-wago-500:W237-102: WAGO SCREW CLAMP; MPN: 237-102; OC_FARNELL: unknown; OC_NEWARK: 70K9898